# EAGLE design utilidong-ftdi-uart-lipo-charger-mk-2.0 (EAGLE 6.5.0)
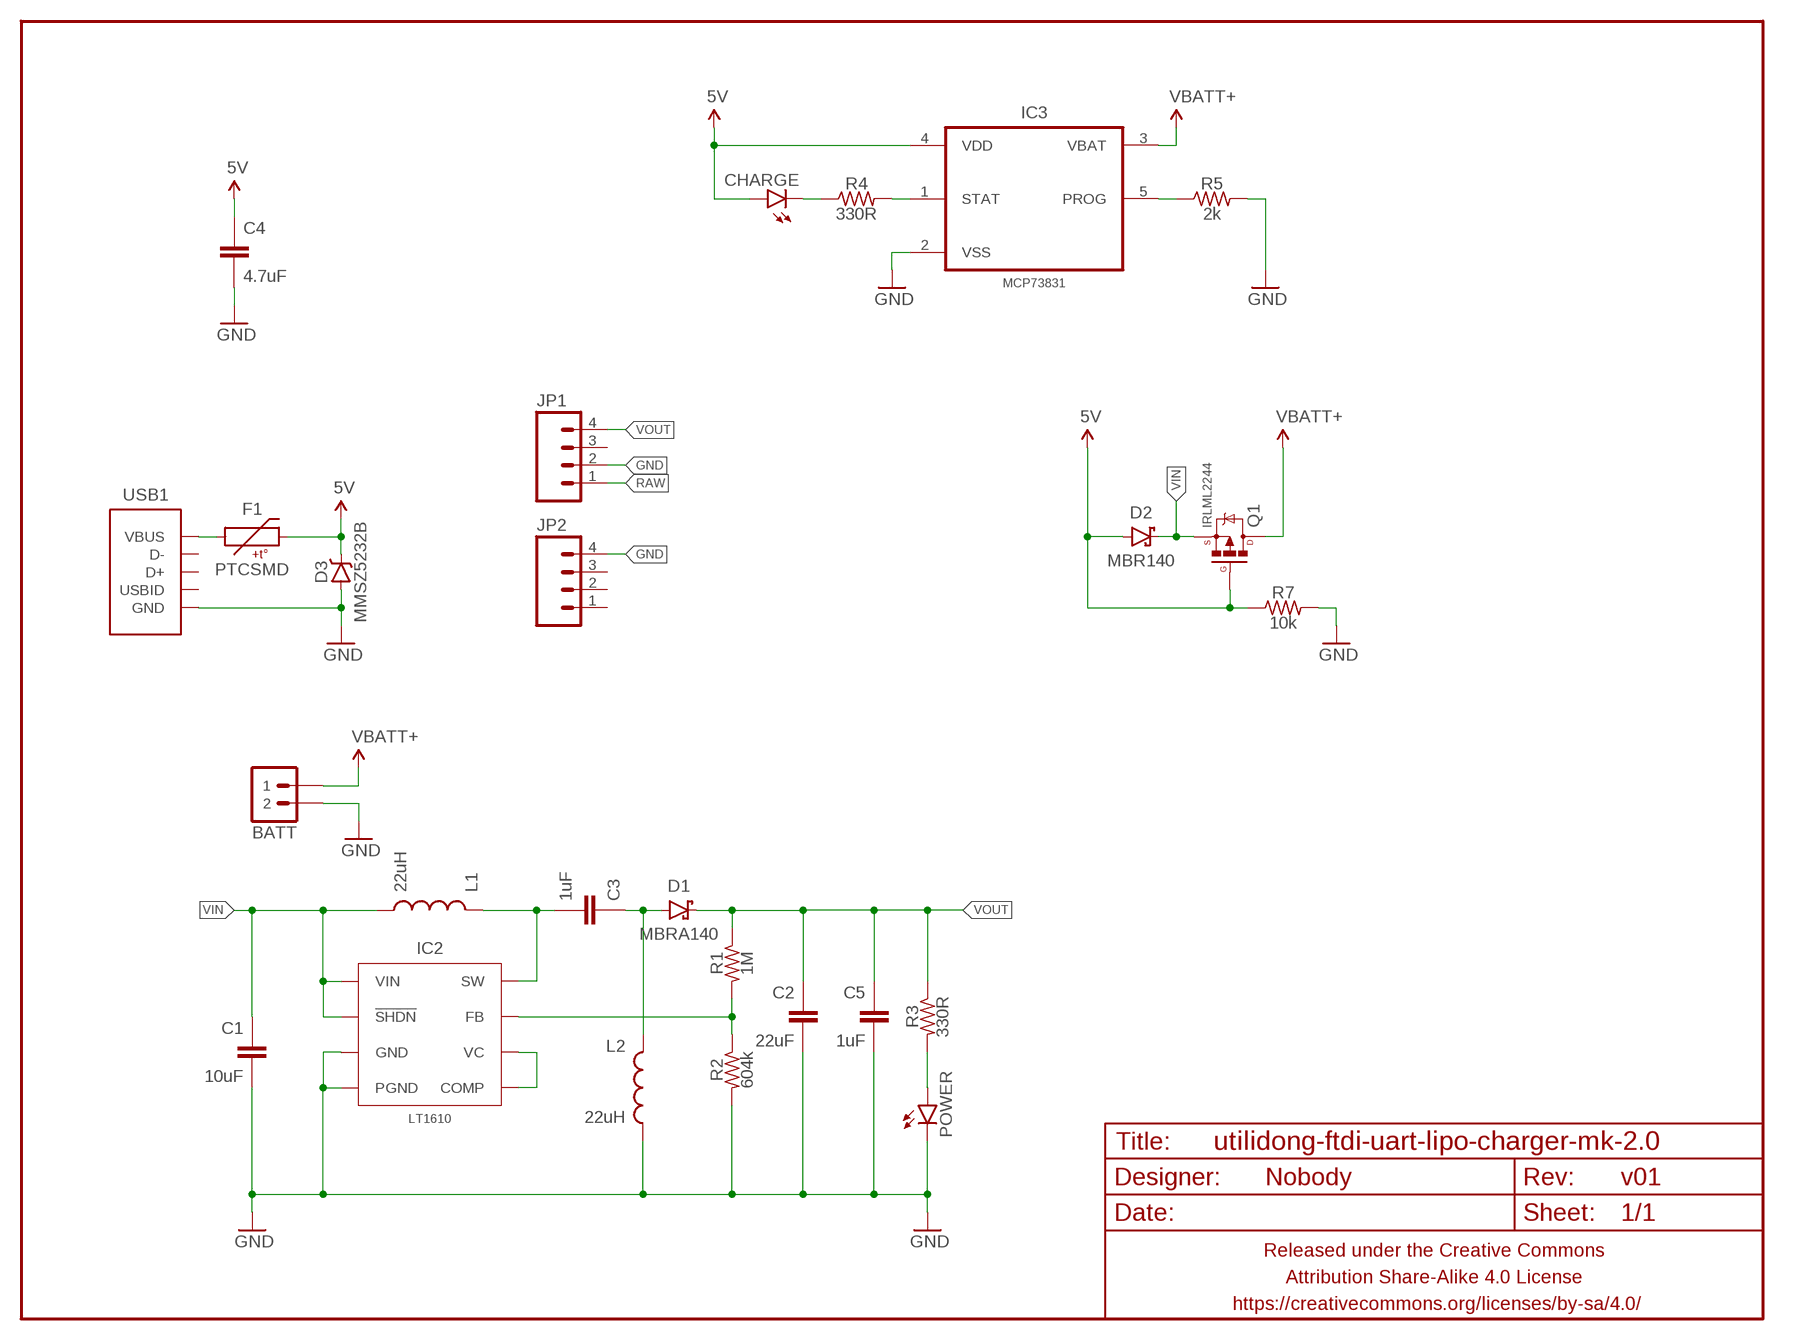
[diagram p0: schematic, sheet 1]

## Parts
BATT  M02JST-2MM-SMT  [JST-2-SMD]
C1  10uF  CAPACITOR-CERAMICC0805  [C0805]
C2  22uF  CAPACITOR-CERAMICC1206  [C1206]
C3  1uF  CAPACITOR-CERAMICC0805  [C0805]
C4  4.7uF  CAPACITOR-CERAMICC0603  [C0603]
C5  1uF  CAPACITOR-CERAMICC0805  [C0805]
CHARGE  LED1206  [LED-1206]
D1  MBRA140  DIODE-SCHOTTKYSOD123  [SOD123-SCHOTTKY]
D2  MBR140  DIODE-SCHOTTKYSOD123  [SOD123-SCHOTTKY]
D3  MMSZ5232B  DIODE-ZENERSOD123  [SOD123-ZENER]
F1  PTCSMD  [PTC-1206]
FRAME1  FRAME-LETTERNO_PACKAGE  [DUMMY]
IC2  LT1610  LT1610SOICN8  [SO08]
IC3  MCP73831  MCP73831T-2ACI/OT  [SOT95P280X145-5N]
JP1  M04PTH  [1X04-PTH-VERT]
JP2  M04PTH  [1X04-PTH-VERT]
L1  22uH  INDUCTORTAIYO-YUDEN-40XX  [TAIYO-YUDEN-40XX]
L2  22uH  INDUCTORTAIYO-YUDEN-40XX  [TAIYO-YUDEN-40XX]
POWER  LED1206  [LED-1206]
Q1  IRLML2244  MOSFET-PCHANNELIRLML2244  [SOT23-3]
R1  1M  RESISTORR0603  [R0603]
R2  604k  RESISTORR0603  [R0603]
R3  330R  RESISTORR0603  [R0603]
R4  330R  RESISTORR0603  [R0603]
R5  2k  RESISTORR0603  [R0603]
R7  10k  RESISTORR0603  [R0603]
USB1  USB-ABCOMBO  [USB-MICRO-B-FCI-CUTOUT]

## Nets
5V: C4.1 CHARGE.A D2.A D3.C F1.2 IC3.4(VDD) Q1.1(G) R7.1
GND: BATT.1 C1.2 C2.2 C4.2 C5.2 D3.A IC2.4(PGND) IC2.7(GND) IC3.2(VSS) JP1.2 JP2.4 L2.2 POWER.C R2.2 R5.2 R7.2 USB1.5(GND) USB1.P$1(GND) USB1.P$2(GND)
N$1: POWER.A R3.2
N$2: C3.2 IC2.5(SW) L1.1
N$3: IC3.1(STAT) R4.2
N$4: IC2.1(VC) IC2.8(COMP)
N$5: C3.1 D1.A L2.1
N$6: CHARGE.C R4.1
N$7: IC2.2(FB) R1.2 R2.1
N$8: IC3.5(PROG) R5.1
N$9: F1.1 USB1.1(VBUS)
RAW: JP1.1
VBATT+: BATT.2 IC3.3(VBAT) Q1.3(D)
VIN: C1.1 D2.C IC2.3(!SHDN) IC2.6(VIN) L1.2 Q1.2(S)
VOUT: C2.1 C5.1 D1.C JP1.4 R1.1 R3.1
Unconnected: JP1.3 JP2.1 JP2.2 JP2.3 USB1.2(D-) USB1.3(D+) USB1.4(USBID)

## Library data of the parts
BATT = A_butts:M02: Standard 2-pin 0.1" header. Use with - straight break away headers ( PRT-00116) - right angle break away headers (PRT-00553) - swiss pins (PRT-00743) - machine pins (PRT-00117) - female headers (PRT-00115) Molex polarized connector foot print use with: PRT-08233 with associated crimp pins and housings. 2.54_SCREWTERM for use with PRT-10571. 3.5mm Screw Terminal footprints for PRT-08084 5mm Screw Terminal footprints for use with PRT-08433; PROD_ID: CONN-08352
C1-C5 = A_butts:CAPACITOR-CERAMIC: CAPACITOR, European symbol
CHARGE POWER = A_butts:LED: LEDs Standard schematic elements and footprints for 5mm, 3mm, 1206, and 0603 sized LEDs. 5mm - Spark Fun Electronics SKU : COM-00529 (and others)
D1 D2 = A_butts:DIODE-SCHOTTKY: Schottky diodes in SFE's production catalog BAT20J 1A 23V 0.62Vf RB751 120mA 40V 0.37Vf PMEG4005EJ 0.5A 40V 0.42Vf MBRA140 1A 40V 0.5Vf B340A 3A 40V SMA
D3 = A_butts:DIODE-ZENER: Zener Diode Production Part - 8199 3.4V Zener Voltage
F1 = A_butts:PTC: Resettable Fuse PTC Resettable Fuse. Spark Fun Electronics SKU : COM-08357; PROD_ID: RES-11150
FRAME1 = A_butts:FRAME-LETTER: Schematic Frame Standard 8.5x11 US Letter frame; DESIGNER: Nobody; VERSION: v01
IC2 = A_butts:LT1610
IC3 = A_butts:MCP73831T-2ACI/OT: Charge Management Controller; MPN: MCP73831T-2ACI/OT; OC_FARNELL: 1332158; OC_NEWARK: 56K7045; PACKAGE: SOT-5; SUPPLIER: Microchip
JP1 JP2 = A_butts:M04: Header 4 Standard 4-pin 0.1" header. Use with straight break away headers (SKU : PRT-00116), right angle break away headers (PRT-00553), swiss pins (PRT-00743), machine pins (PRT-00117), and female headers (PRT-00115). Molex polarized connector foot print use with SKU : PRT-08231 with associated crimp pins and housings. 1MM SMD Version SKU: PRT-10208
L1 L2 = A_butts:INDUCTOR: Inductors Basic Inductor/Choke - 0603 and 1206. Footprints are not proven and vary greatly between part numbers. SRN6045- 33uH, 20% 1.4A SDR0403-560KL - 56uH, 10%, 500mA RMS/740mA peak
Q1 = A_butts:MOSFET-PCHANNEL: Generic PMOSFET IRLML2244 - TRANS-11153 (SOT-23 -20V -4.3A) (1.Gate 2.Source 3.Drain) FQP27P06 - COM-10349 <http://www.sparkfun.com/products/10349> (TO-220 -60V -27A) (1.Gate 2.Source 3.Drain); PROD_ID: TRANS-11153
R1-R5 R7 = A_butts:RESISTOR: RESISTOR, American symbol
USB1 = A_butts:USB-AB: This is a USB AB connector that is compatible with USB OTG. i.e. this connector can serve as a host or device

## Board
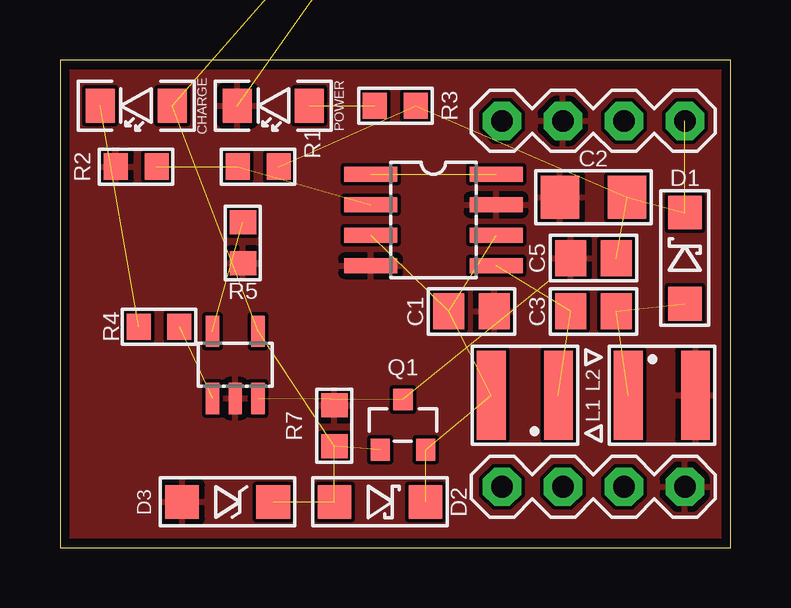
[diagram p1: board, top side]
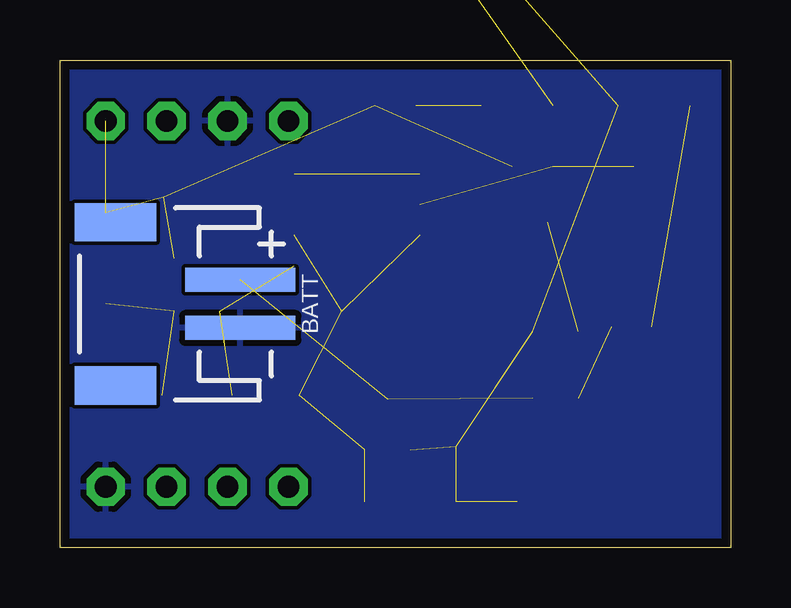
[diagram p2: board, bottom side, seen from below]

Size 27.94 x 20.32 mm. Coordinates in mm from the lower left corner, seen from the top.
Outline: 0,0 27.94,0 27.94,20.32 0,20.32 0,0
Copper layers (1*16): Top 0.0356mm / dielectric 1.5011mm / Bottom 0.0356mm
Design rules "LaenPCBOrder2": minimum track width 6mil, minimum drill 13mil, track to track 6mil, track to pad 6mil, pad to pad 6mil, via to via 6mil, smd to smd 6mil, copper to edge 15mil, drill to drill 6mil, minimum pad ring 7mil, minimum via ring 7mil, stop-mask expansion 3mil, vias tented up to drill 20mil, thermal gap 10mil

### Footprints (pad centres in the part's own frame; a part is rotated, then mirrored left to right if it is on the bottom)
JST-2-SMD = smd 1 x 4.6: 1 -1,-3.7; 2 1,-3.7 | smd 1.6 x 3.4: NC1 -3.4,1.5; NC2 3.4,1.5
C0805 = smd 1.3 x 1.5: 1 -0.95,0; 2 0.95,0
C1206 = smd 1.6 x 1.8: 1 -1.4,0; 2 1.4,0
C0603 = smd 1.1 x 1: 1 -0.85,0; 2 0.85,0
LED-1206 = smd 1.2 x 1.4: A -1.5,0; C 1.5,0
SOD123-SCHOTTKY = smd 1.4 x 1.4: A -1.9,0; C 1.9,0
SOD123-ZENER = smd 1.4 x 1.4: A -1.9,0; C 1.9,0
PTC-1206 = smd 1 x 1.8: 1 -1.4,0; 2 1.4,0
SO08 = smd 0.61 x 2.21: 1 -1.905,-2.616; 2 -0.635,-2.616; 3 0.635,-2.616; 4 1.905,-2.616; 5 1.905,2.616; 6 0.635,2.616; 7 -0.635,2.616; 8 -1.905,2.616
SOT95P280X145-5N = smd 1.3 x 0.55: 1 -1.4,0.95; 2 -1.4,0; 3 -1.4,-0.95; 4 1.4,-0.95; 5 1.4,0.95
1X04-PTH-VERT = drill 0.9 pad 1.6 octagon: 1 0,0; 2 2.54,0; 3 5.08,0; 4 7.62,0
TAIYO-YUDEN-40XX = smd 1.2 x 3.7: 1 -1.4,0; 2 1.4,0
SOT23-3 = smd 0.8 x 0.9: 1 -0.95,-1; 2 0.95,-1; 3 0,1.1
R0603 = smd 1 x 1.1: 1 -0.85,0; 2 0.85,0
USB-MICRO-B-FCI-CUTOUT = smd 0.4 x 1.5: 1 -1.3,0; 2 -0.65,0; 3 0,0; 4 0.65,0; 5 1.3,0 | smd 1.15 x 1.5: P$1 -2.325,0; P$2 2.325,0 | drill 1.2: P$3 -5.1,-0.2; P$4 5.1,-0.2; P$5 -5.1,-3.9; P$6 5.1,-3.9

### Placement (x,y rotation side)
BATT  24.13,10.16 90 bottom
C1  17.14,9.84 0 top
C2  22.23,14.61 180 top
C3  22.23,9.84 180 top
C4  10.79,24.45 0 top  (outside the outline)
C5  22.23,12.06 180 top
CHARGE  3.17,18.41 180 top
D1  26.04,12.06 90 top
D2  13.34,1.91 0 top
D3  6.99,1.91 0 top
F1  16.51,24.45 180 top  (outside the outline)
FRAME1  0,0 0 top
IC2  15.56,13.65 270 top
IC3  7.3,7.62 90 top
JP1  18.41,17.78 0 top
JP2  18.41,2.54 0 top
L1  19.37,6.35 180 top
L2  25.08,6.35 0 top
POWER  8.89,18.41 180 top
Q1  14.29,5.08 0 top
R1  8.26,15.88 180 top
R2  3.17,15.88 180 top
R3  13.97,18.41 180 top
R4  4.13,9.21 0 top
R5  7.62,12.7 270 top
R7  11.43,5.08 90 top
USB1  24.77,35.56 90 bottom  (outside the outline)

### Tracks (layer width: path | path; a pad name or v marks a point on that pad's centre or on a via)
5V  (7 unrouted)
GND  (4 unrouted)
  pour Top: 0,0 0,20.32 27.94,20.32 27.94,0
  pour Bottom: 0,0 0,20.32 27.94,20.32 27.94,0
N$1  (1 unrouted)
N$2  (2 unrouted)
N$3  (1 unrouted)
N$4  (1 unrouted)
N$5  (2 unrouted)
N$6  (1 unrouted)
N$7  (2 unrouted)
N$8  (1 unrouted)
N$9  (1 unrouted)
VBATT+  (2 unrouted)
VIN  (5 unrouted)
VOUT  (5 unrouted)